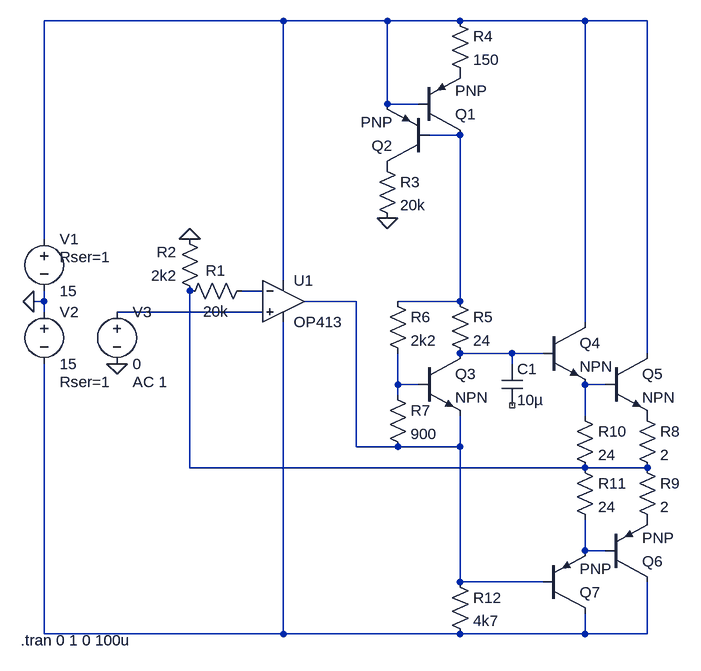
[diagram p0: schematic opamp_amplifier.asc]
opamp_amplifier.asc, the LTspice schematic file:
Version 4
SHEET 1 1144 680
WIRE 416 -432 48 -432
WIRE 576 -432 416 -432
WIRE 688 -432 576 -432
WIRE 880 -432 688 -432
WIRE 976 -432 880 -432
WIRE 576 -304 576 -432
WIRE 624 -304 576 -304
WIRE 688 -256 640 -256
WIRE 48 -96 48 -432
WIRE 416 -32 416 -432
WIRE 384 -16 352 -16
WIRE 48 0 48 -16
WIRE 48 0 32 0
WIRE 528 0 448 0
WIRE 688 0 688 -256
WIRE 688 0 592 0
WIRE 48 16 48 0
WIRE 384 16 160 16
WIRE 880 32 880 -432
WIRE 768 80 688 80
WIRE 816 80 768 80
WIRE 976 80 976 -432
WIRE 768 96 768 80
WIRE 592 128 592 80
WIRE 624 128 592 128
WIRE 912 128 880 128
WIRE 592 144 592 128
WIRE 880 176 880 128
WIRE 528 224 528 0
WIRE 592 224 528 224
WIRE 688 224 688 176
WIRE 688 224 592 224
WIRE 272 256 272 -16
WIRE 880 256 272 256
WIRE 976 256 880 256
WIRE 880 384 880 336
WIRE 912 384 880 384
WIRE 688 432 688 224
WIRE 816 432 688 432
WIRE 48 512 48 96
WIRE 416 512 416 32
WIRE 416 512 48 512
WIRE 688 512 416 512
WIRE 880 512 880 480
WIRE 880 512 688 512
WIRE 976 512 976 432
WIRE 976 512 880 512
FLAG 32 0 0
FLAG 160 96 0
FLAG 272 -96 0
FLAG 576 -128 0
SYMBOL OpAmps\\OP413 416 -64 R0
SYMATTR InstName U1
SYMBOL voltage 48 -112 R0
WINDOW 123 0 0 Left 0
WINDOW 39 24 44 Left 2
SYMATTR InstName V1
SYMATTR Value 15
SYMATTR SpiceLine Rser=1
SYMBOL voltage 48 0 R0
WINDOW 123 0 0 Left 0
WINDOW 39 24 124 Left 2
SYMATTR InstName V2
SYMATTR Value 15
SYMATTR SpiceLine Rser=1
SYMBOL res 368 -32 R90
WINDOW 0 0 56 VBottom 2
WINDOW 3 32 56 VTop 2
SYMATTR InstName R1
SYMATTR Value 20k
SYMBOL res 288 0 R180
WINDOW 0 36 76 Left 2
WINDOW 3 36 40 Left 2
SYMATTR InstName R2
SYMATTR Value 2k2
SYMBOL voltage 160 0 R0
WINDOW 123 24 124 Left 2
WINDOW 39 0 0 Left 0
SYMATTR InstName V3
SYMATTR Value 0
SYMATTR Value2 AC 1
SYMBOL pnp 624 -256 M180
SYMATTR InstName Q1
SYMBOL pnp 640 -208 R180
SYMATTR InstName Q2
SYMBOL res 560 -224 R0
SYMATTR InstName R3
SYMATTR Value 20k
SYMBOL res 672 -448 R0
SYMATTR InstName R4
SYMATTR Value 150
SYMBOL npn 624 80 R0
SYMATTR InstName Q3
SYMBOL res 672 -16 R0
SYMATTR InstName R5
SYMATTR Value 24
SYMBOL cap 752 96 R0
SYMATTR InstName C1
SYMATTR Value 10µ
SYMBOL res 576 -16 R0
SYMATTR InstName R6
SYMATTR Value 2k2
SYMBOL res 576 128 R0
SYMATTR InstName R7
SYMATTR Value 900
SYMBOL npn 816 32 R0
SYMATTR InstName Q4
SYMBOL npn 912 80 R0
SYMATTR InstName Q5
SYMBOL pnp 912 432 M180
SYMATTR InstName Q6
SYMBOL pnp 816 480 M180
SYMATTR InstName Q7
SYMBOL res 960 160 R0
SYMATTR InstName R8
SYMATTR Value 2
SYMBOL res 960 240 R0
SYMATTR InstName R9
SYMATTR Value 2
SYMBOL res 864 160 R0
SYMATTR InstName R10
SYMATTR Value 24
SYMBOL res 864 240 R0
SYMATTR InstName R11
SYMATTR Value 24
SYMBOL res 672 416 R0
SYMATTR InstName R12
SYMATTR Value 4k7
TEXT 12 522 Left 2 !.tran 0 1 0 100u

The netlist it stands for:
* opamp_amplifier.asc
XU1 N005 N003 N001 N011 N004 OP413  ; pins In+ In- V+ V- OUT
V1 N001 0 15 Rser=1
V2 0 N011 15 Rser=1
R1 N003 N009 20k
R2 N009 0 2k2
V3 N005 0 0 AC 1
Q1 N002 N001 P001 0 PNP
Q2 P002 N002 N001 0 PNP
R3 P002 0 20k
R4 N001 P001 150
Q3 N006 N007 N004 0 NPN
R5 N002 N006 24
C1 N006 NC_01 10µ
R6 N002 N007 2k2
R7 N007 N004 900
Q4 N001 N006 N008 0 NPN
Q5 N001 N008 P003 0 NPN
Q6 N011 N010 P004 0 PNP
Q7 N011 N004 N010 0 PNP
R8 P003 N009 2
R9 N009 P004 2
R10 N008 N009 24
R11 N009 N010 24
R12 N004 N011 4k7
.model NPN NPN
.model PNP PNP
.lib standard.bjt
.tran 0 1 0 100u
.backanno
.end